# EAGLE schematic inputmgr (EAGLE 7.5.0)
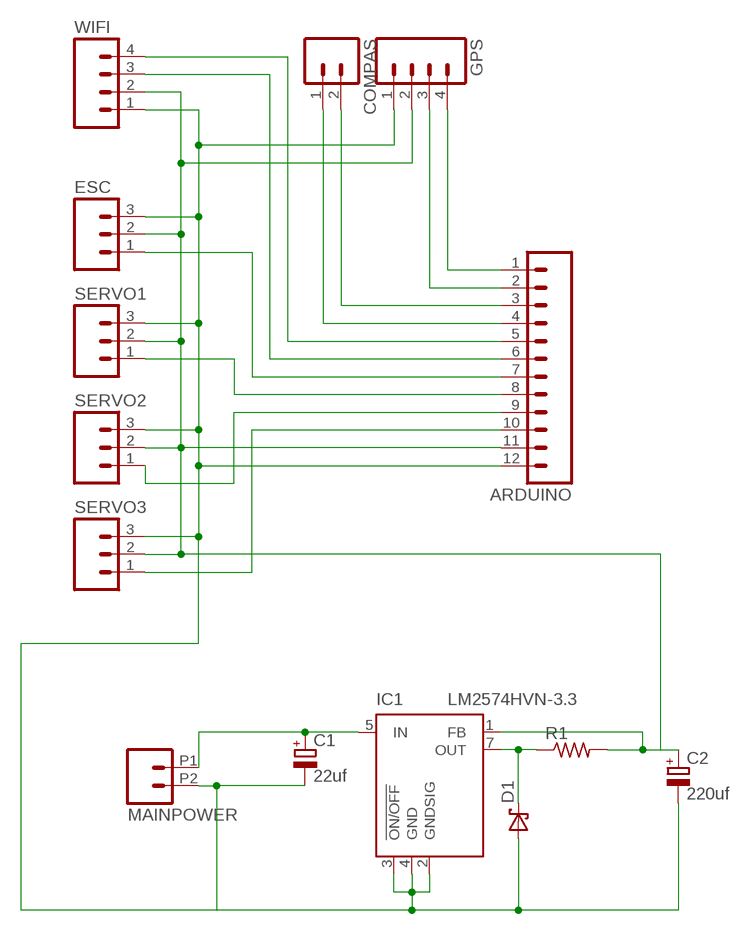
[diagram p0: schematic, sheet 1]

## Parts
ARDUINO  M12PTH  [1X12]
C1  22uf  CPOL-EUE2.5-6  [E2,5-6]
C2  220uf  CPOL-EUE2.5-6  [E2,5-6]
COMPAS  M02PTH  [1X02]
D1  DS_E2L  [E2LINE]
ESC  M03PTH  [1X03]
GPS  M04PTH  [1X04]
IC1  LM2574HVN-3.3  [DIL08]
MAINPOWER  M022.54MM_SCREWTERM  [1X02_2.54_SCREWTERM]
R1  R-US_0207/7  [0207/7]
SERVO1  M03PTH  [1X03]
SERVO2  M03PTH  [1X03]
SERVO3  M03PTH  [1X03]
WIFI  M04LOCK  [1X04_LOCK]

## Nets
ARDUINO: ARDUINO.2 GPS.3
N$1: ARDUINO.10 SERVO3.1
N$2: ARDUINO.9 SERVO2.1
N$3: ARDUINO.8 SERVO1.1
N$4: ARDUINO.7 ESC.1
N$5: ARDUINO.6 WIFI.3
N$6: C1.+ IC1.5(IN) MAINPOWER.P1
N$7: ARDUINO.11 C2.+ ESC.2 GPS.2 IC1.1(FB) R1.2 SERVO1.2 SERVO2.2 SERVO3.2 WIFI.2
N$8: ARDUINO.12 C1.- C2.- D1.2(A) ESC.3 GPS.1 IC1.2(GNDSIG) IC1.3(!ON/OFF) IC1.4(GND) MAINPOWER.P2 SERVO1.3 SERVO2.3 SERVO3.3 WIFI.1
N$9: D1.1(K) IC1.7(OUT) R1.1
N$10: ARDUINO.5 WIFI.4
N$11: ARDUINO.4 COMPAS.1
N$12: ARDUINO.3 COMPAS.2
N$14: ARDUINO.1 GPS.4

## Library data of the parts
ARDUINO = SparkFun-Connectors:M12: Header 12 Standard 12-pin 0.1" header. Use with straight break away headers (SKU : PRT-00116), right angle break away headers (PRT-00553), swiss pins (PRT-00743), machine pins (PRT-00117), and female headers (PRT-00115).
C1 C2 = resistor:CPOL-EU: POLARIZED CAPACITOR, European symbol
COMPAS MAINPOWER = SparkFun-Connectors:M02: Standard 2-pin 0.1" header. Use with - straight break away headers ( PRT-00116) - right angle break away headers (PRT-00553) - swiss pins (PRT-00743) - machine pins (PRT-00117) - female headers (PRT-00115) Molex polarized connector foot print use with: PRT-08233 with associated crimp pins and housings. 2.54_SCREWTERM for use with PRT-10571. 3.5mm Screw Terminal footprints for PRT-08084 5mm Screw Terminal footprints for use with PRT-08432
D1 = zetex:DS_E2L: SHOTTKY DIODE; OC_FARNELL: unknown; OC_NEWARK: unknown
ESC SERVO1-SERVO3 = SparkFun-Connectors:M03: Header 3 Standard 3-pin 0.1" header. Use with straight break away headers (SKU : PRT-00116), right angle break away headers (PRT-00553), swiss pins (PRT-00743), machine pins (PRT-00117), and female headers (PRT-00115). Molex polarized connector foot print use with SKU : PRT-08232 with associated crimp pins and housings.
GPS WIFI = SparkFun-Connectors:M04: Header 4 Standard 4-pin 0.1" header. Use with straight break away headers (SKU : PRT-00116), right angle break away headers (PRT-00553), swiss pins (PRT-00743), machine pins (PRT-00117), and female headers (PRT-00115). Molex polarized connector foot print use with SKU : PRT-08231 with associated crimp pins and housings. 1MM SMD Version SKU: PRT-10208; PROD_ID: CONN-09696
IC1 = linear:LM2574?-*: SIMPLE SWITCHER 0.5A Step-Down Voltage Regulator Source: http://cache.national.com/ds/LM/LM2574.pdf
R1 = rcl:R-US_: RESISTOR, American symbol